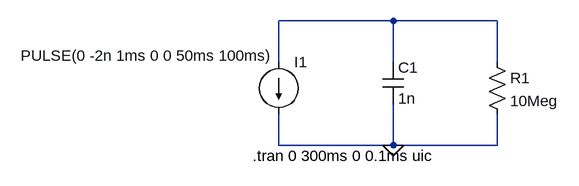
[diagram p0: schematic LIF.asc]
LIF.asc, the LTspice schematic file:
Version 4
SHEET 1 880 680
WIRE 288 80 112 80
WIRE 448 80 288 80
WIRE 112 144 112 80
WIRE 288 144 288 80
WIRE 448 144 448 80
WIRE 112 272 112 224
WIRE 288 272 288 208
WIRE 288 272 112 272
WIRE 448 272 448 224
WIRE 448 272 288 272
FLAG 288 272 0
SYMBOL current 112 144 R0
WINDOW 3 -397 -10 Left 2
WINDOW 123 0 0 Left 0
WINDOW 39 0 0 Left 0
SYMATTR InstName I1
SYMATTR Value PULSE(0 -2n 1ms 0 0 50ms 100ms)
SYMBOL cap 272 144 R0
SYMATTR InstName C1
SYMATTR Value 1n
SYMBOL res 432 128 R0
SYMATTR InstName R1
SYMATTR Value 10Meg
TEXT 72 288 Left 2 !.tran 0 300ms 0 0.1ms uic

The netlist it stands for:
* LIF.asc
I1 N001 0 PULSE(0 -2n 1ms 0 0 50ms 100ms)
C1 N001 0 1n
R1 N001 0 10Meg
.tran 0 300ms 0 0.1ms uic
.backanno
.end